# EAGLE design Receptor RF (EAGLE 6.5.0)
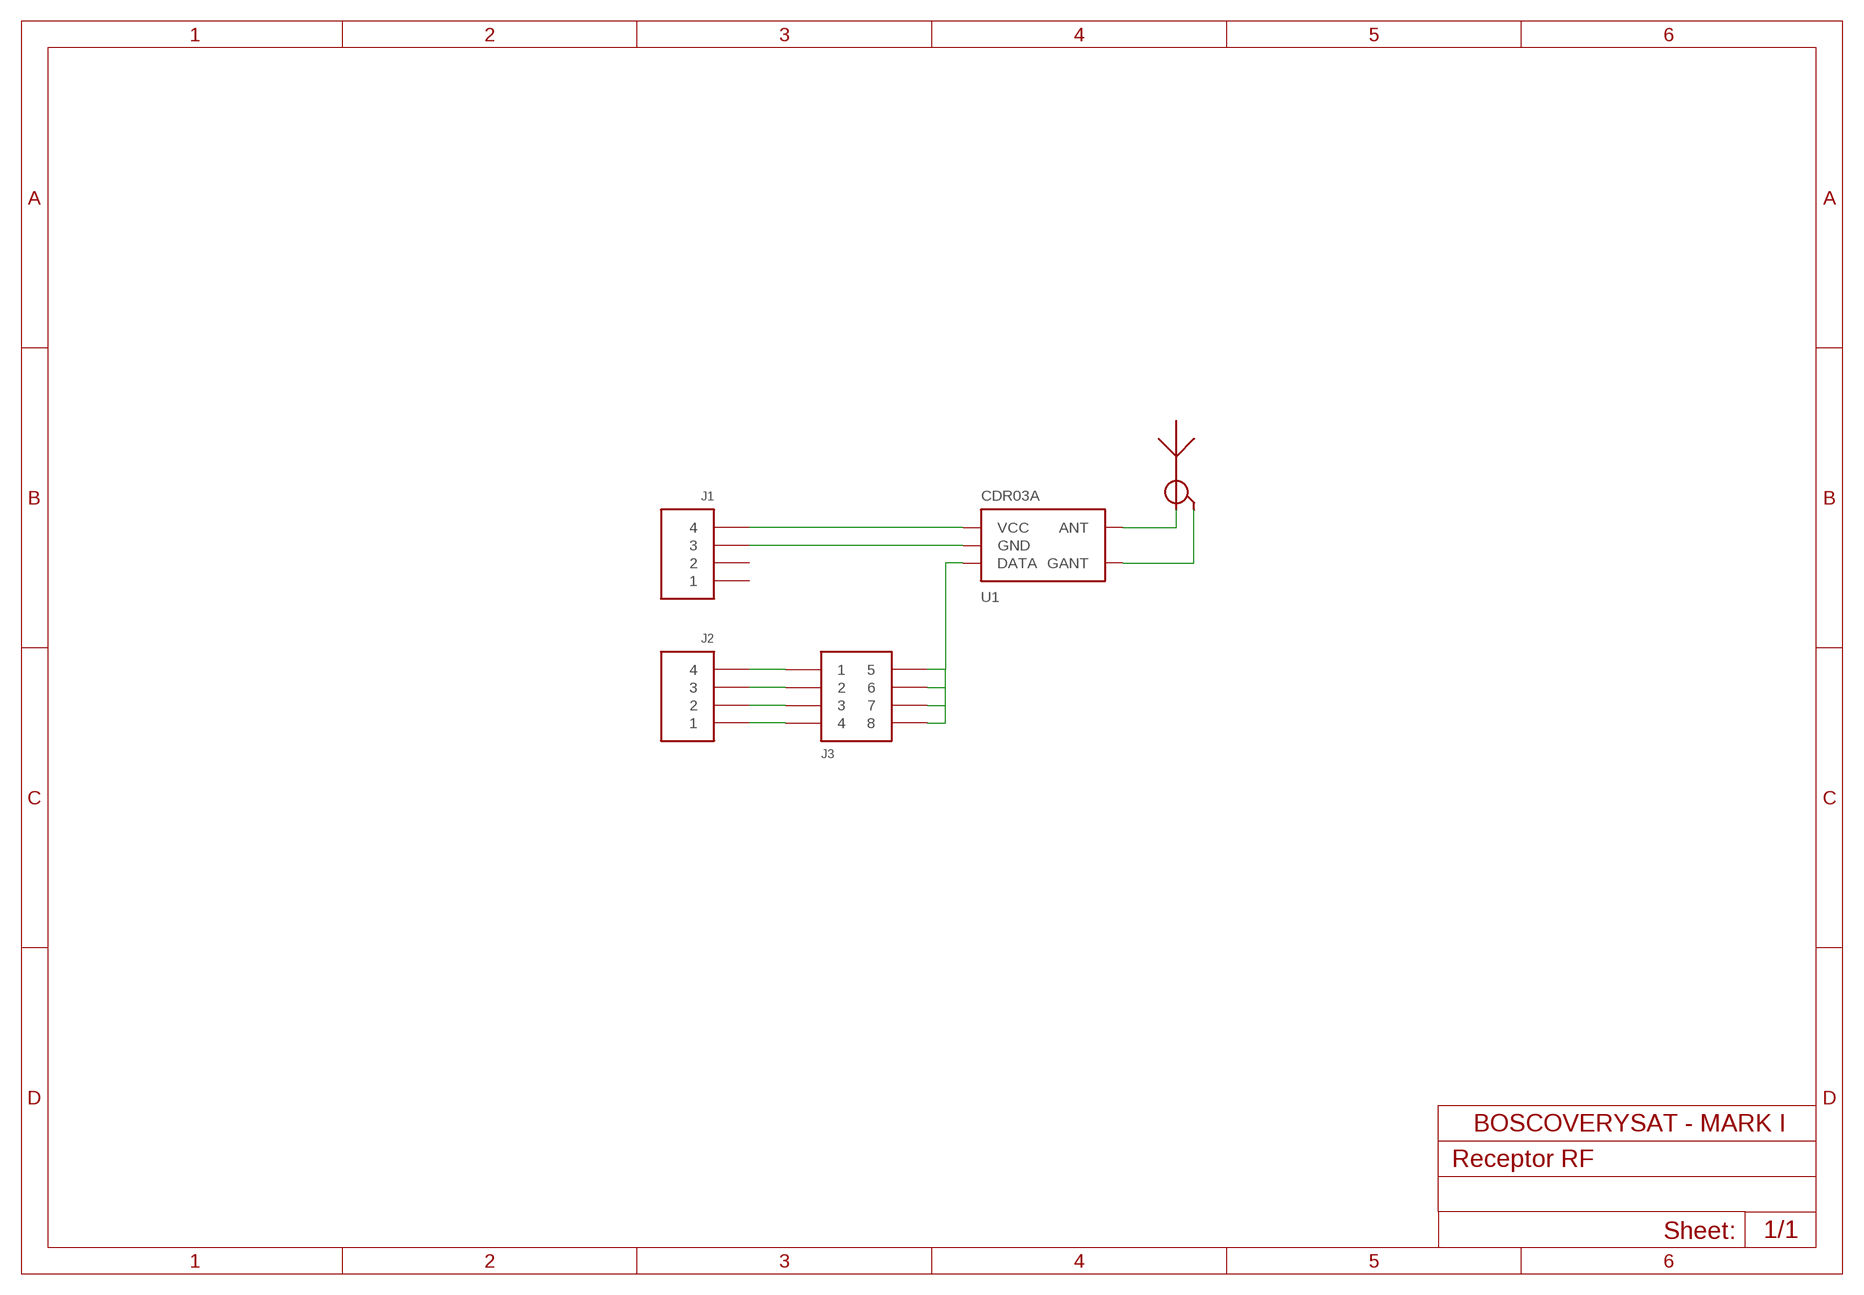
[diagram p0: schematic, sheet 1]

## Parts
J1  4-PIN-LINEAR-JUMPER  [4-PIN-LINEAR-JUMPER]
J2  4-PIN-LINEAR-JUMPER  [4-PIN-LINEAR-JUMPER]
J3  8-PIN-JUMPER  [8-PIN-JUMPER]
U1  CDR03A  [CDR03A]
U$3  ANTENNA  [ANTENNA]

## Nets
N$1: J1.P$4 U1.VCC
N$2: J1.P$3 U1.GND
N$3: J2.P$4 J3.P$1
N$4: U1.ANT U$3.ANT
N$5: U1.GANT U$3.GANT
N$6: J2.P$3 J3.P$2
N$7: J2.P$2 J3.P$3
N$8: J2.P$1 J3.P$4
N$9: J3.P$5 J3.P$6 J3.P$7 J3.P$8 U1.DATA1(DATA) U1.DATA2(DATA)
Unconnected: J1.P$1 J1.P$2

## Library data of the parts
J1 J2 = boscoverysat:4-PIN-LINEAR-JUMPER
J3 = boscoverysat:8-PIN-JUMPER
U1 = boscoverysat:CDR03A
U$3 = boscoverysat:ANTENNA

## Board
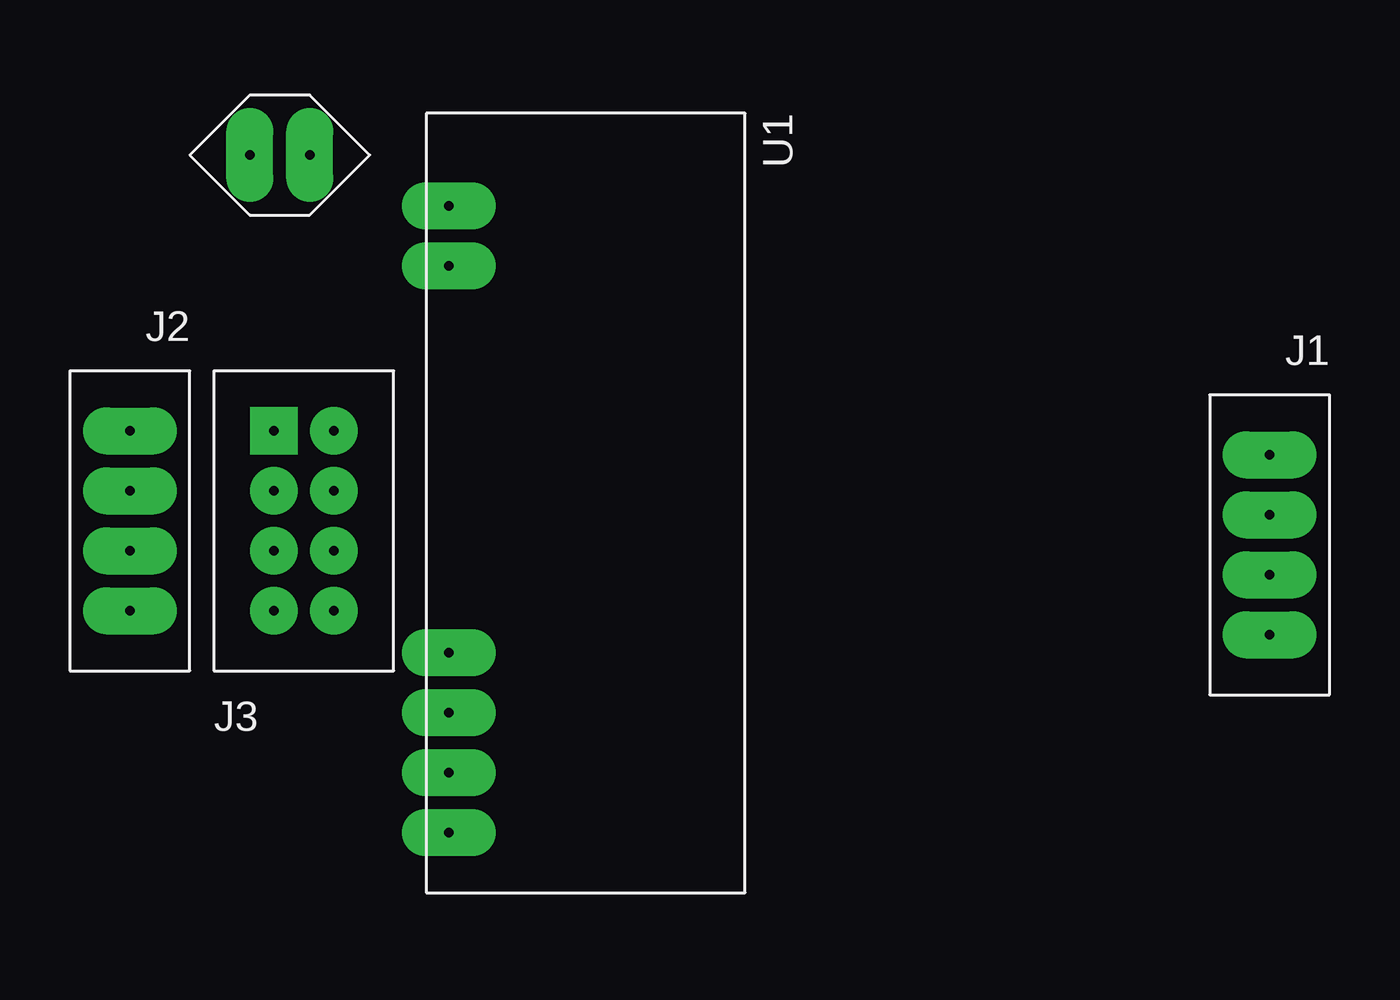
[diagram p1: board, top side]
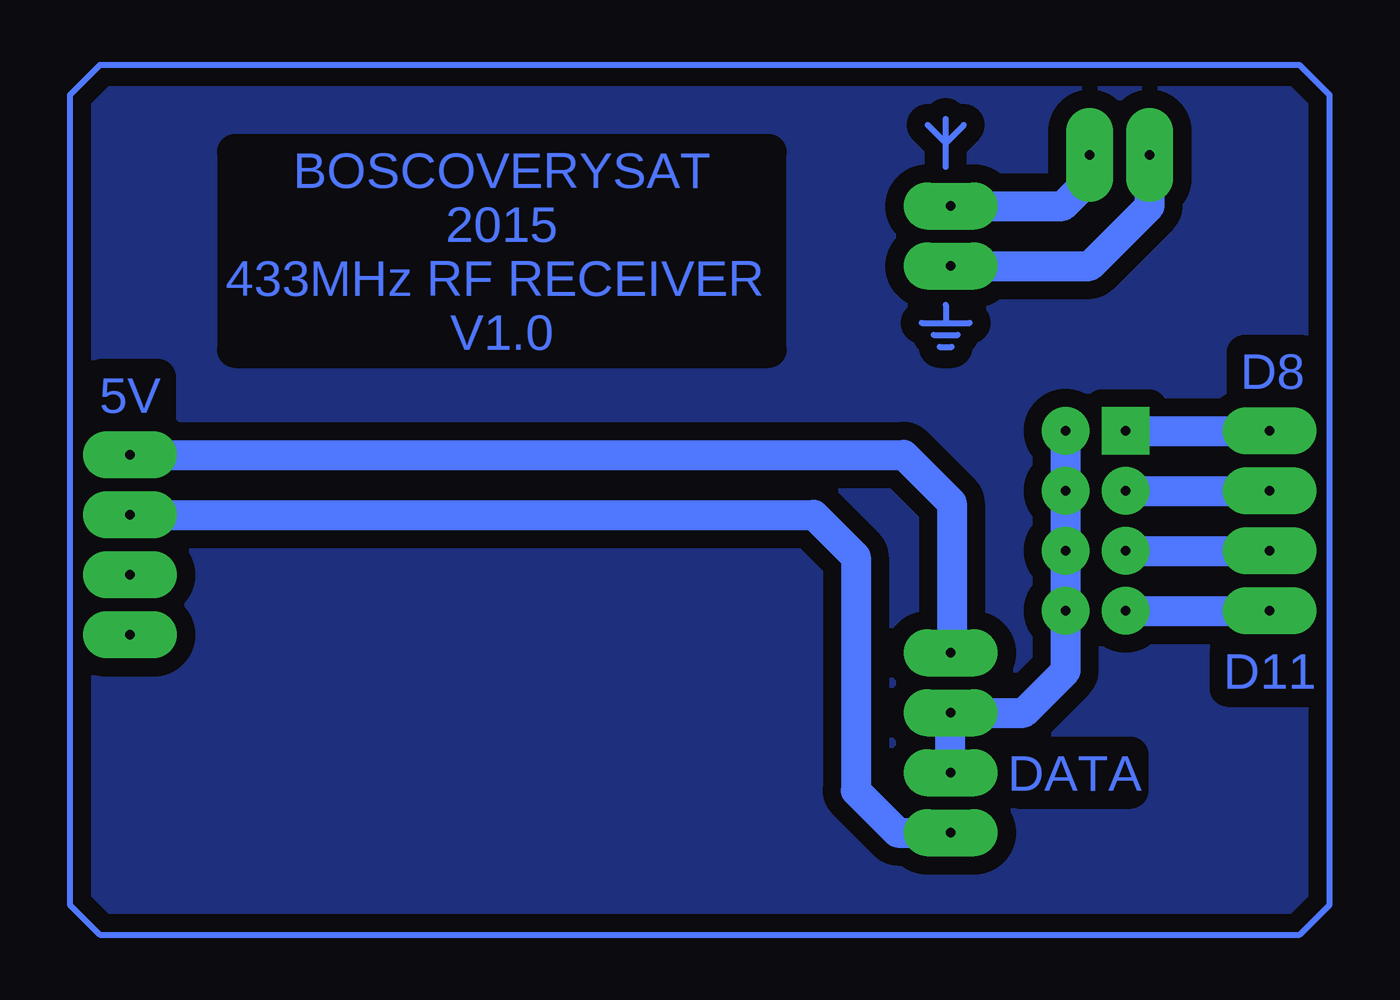
[diagram p2: board, bottom side, seen from below]

No outline drawn. Coordinates in mm, seen from the top.
Copper layers (1*16): Top 0.035mm / dielectric 1.5mm / Bottom 0.035mm
Design rules "default *": minimum track width 10mil, minimum drill 24mil, track to track 30mil, track to pad 30mil, pad to pad 30mil, via to via 30mil, smd to smd 8mil, copper to edge 40mil, drill to drill 8mil, minimum pad ring 10mil, minimum via ring 8mil, stop-mask expansion 4mil, vias tented up to drill 0mil, thermal gap 10mil

### Footprints (pad centres in the part's own frame; a part is rotated, then mirrored left to right if it is on the bottom)
4-PIN-LINEAR-JUMPER = drill 0.4 pad 2 long: P$1 2.54,10.16; P$2 2.54,7.62; P$3 2.54,5.08; P$4 2.54,2.54
8-PIN-JUMPER = drill 0.4 pad 2 square: P$1 2.54,10.16 | drill 0.4 pad 2: P$2 2.54,7.62; P$3 2.54,5.08; P$4 2.54,2.54; P$5 5.08,10.16; P$6 5.08,7.62; P$7 5.08,5.08; P$8 5.08,2.54
CDR03A = drill 0.4 pad 2 long: ANT 13.08,5.54; DATA1 -10.92,5.54; DATA2 -8.38,5.54; GANT 10.54,5.54; GND -13.46,5.54; VCC -5.84,5.54
ANTENNA = drill 0.4 pad 2 long: ANT 5.08,2.54; GANT 2.54,2.54

### Placement (x,y rotation side)
J1  53.34,22.86 180 top
J2  5.08,23.88 180 top
J3  6.1,11.18 0 top
U1  21.59,17.78 90 top
U$3  5.08,30.48 0 top

### Tracks (layer width: path | path; a pad name or v marks a point on that pad's centre or on a via)
N$1
  Bottom 1.27: J1.P$4 18.03,20.32 16,18.29 16,11.99 U1.VCC
N$2
  Bottom 1.27: J1.P$3 21.84,17.78 20.07,16 20.07,6.1 18.29,4.32 U1.GND
N$3
  Bottom 1.27: J3.P$1 J2.P$4
N$4
  Bottom 1.27: U1.ANT 11.3,30.86 10.16,32 U$3.ANT
N$5
  Bottom 1.27: U1.GANT 10.16,28.32 7.62,30.86 U$3.GANT
N$6
  Bottom 1.27: J3.P$2 J2.P$3
N$7
  Bottom 1.27: J3.P$3 J2.P$2
N$8
  Bottom 1.27: J3.P$4 J2.P$1
N$9
  Bottom 1.27: U1.DATA1 U1.DATA2 12.95,9.4 11.18,11.18 J3.P$8 J3.P$7 J3.P$6 J3.P$5
N$10
  Bottom 0.254: 16.26,32.51 16.26,33.53 | 16.26,33.53 16.26,34.54 | 16.26,33.53 15.49,34.29 | 16.26,33.53 17.02,34.29
N$11
  Bottom 0.254: 16.26,26.67 16.26,25.91
N$12
  Bottom 0.254: 17.27,25.91 15.24,25.91
N$13
  Bottom 0.254: 16.76,25.4 15.75,25.4
N$14
  Bottom 0.254: 16.51,24.89 16,24.89
N$15
  Bottom 0.254: 0,35.56 1.27,36.83 52.07,36.83 53.34,35.56 53.34,1.27 52.07,0 1.27,0 0,1.27 0,35.56
N$16
  pour Bottom: 1.27,36.83 0,35.56 0,1.27 1.27,0 52.07,0 53.34,1.27 53.34,35.56 52.07,36.83

### Text on the board
Bottom: BOSCOVERYSAT / 2015 / 433MHz RF RECEIVER / V1.0 | D8 | 5V | D11 | DATA